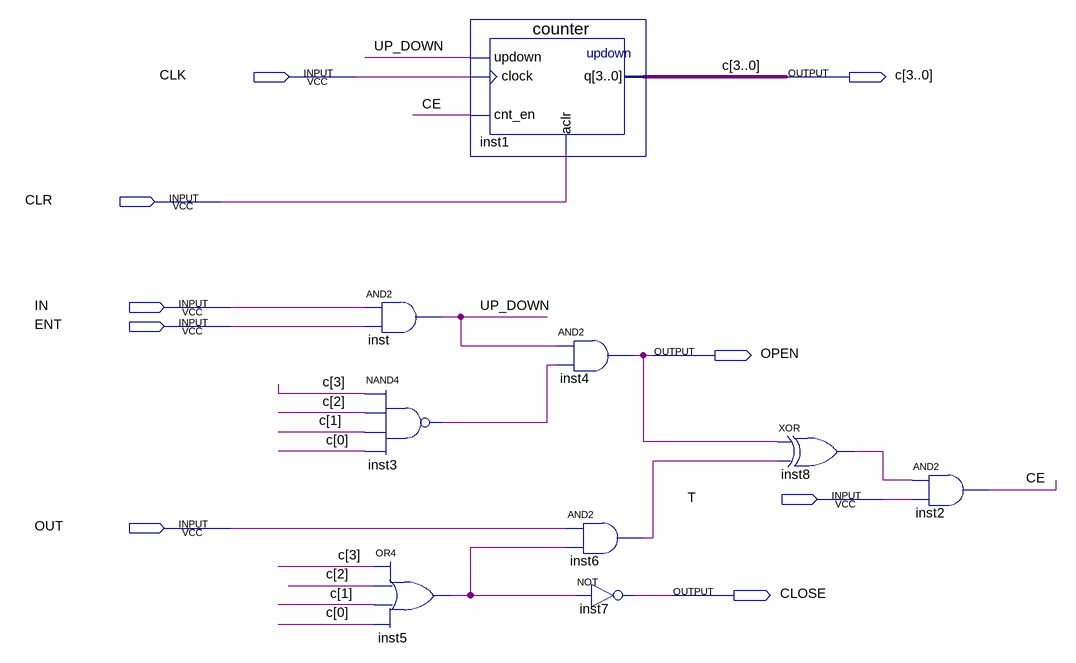
[diagram p0: schematic sheet]
// Quartus schematic Waiting Room.bdf as structural Verilog: 9 symbols, 9 pins
module \Waiting_Room  (
  input  CLK,
  input  CLR,
  input  IN,
  input  ENT,
  input  T,
  input  OUT,
  output [3:0] c,
  output OPEN,
  output CLOSE
);

  wire CE, inst3_out, inst5_out, inst6_out, inst8_out, UP_DOWN;

  and inst (UP_DOWN, IN, ENT);
  nand inst3 (inst3_out, c[3], c[2], c[1], c[0]);
  or inst5 (inst5_out, c[3], c[2], c[1], c[0]);
  counter inst1 (.updown(UP_DOWN), .clock(CLK), .cnt_en(CE), .aclr(CLR), .q(c));
  and inst4 (OPEN, UP_DOWN, inst3_out);
  and inst6 (inst6_out, OUT, inst5_out);
  not inst7 (CLOSE, inst5_out);
  xor inst8 (inst8_out, OPEN, inst6_out);
  and inst2 (CE, inst8_out, T);
endmodule
